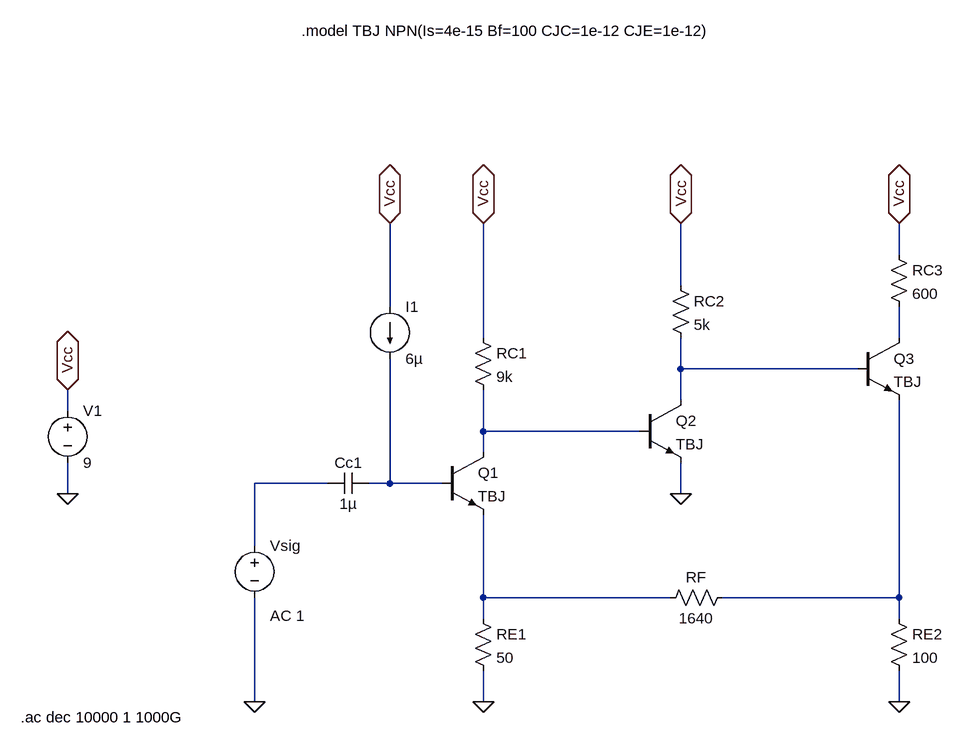
[diagram p0: schematic Realimentacao - Serie - Serie - TBJ - Emissor Comum.asc]
Realimentacao - Serie - Serie - TBJ - Emissor Comum.asc, the LTspice schematic file:
Version 4
SHEET 1 936 1096
WIRE 864 368 864 320
WIRE 528 416 528 320
WIRE 80 448 80 320
WIRE 224 496 224 320
WIRE 864 496 864 448
WIRE 528 544 528 496
WIRE 800 544 528 544
WIRE 528 592 528 544
WIRE -416 608 -416 576
WIRE 224 640 224 576
WIRE 464 640 224 640
WIRE 224 672 224 640
WIRE -16 720 -128 720
WIRE 80 720 80 528
WIRE 80 720 48 720
WIRE 160 720 80 720
WIRE -416 736 -416 688
WIRE 528 736 528 688
WIRE -128 816 -128 720
WIRE 224 896 224 768
WIRE 512 896 224 896
WIRE 864 896 864 592
WIRE 864 896 592 896
WIRE 224 928 224 896
WIRE 864 928 864 896
WIRE -128 1056 -128 896
WIRE 224 1056 224 1008
WIRE 864 1056 864 1008
FLAG 224 1056 0
FLAG 864 1056 0
FLAG 528 736 0
FLAG -416 736 0
FLAG -416 576 Vcc
IOPIN -416 576 BiDir
FLAG 224 320 Vcc
IOPIN 224 320 BiDir
FLAG 528 320 Vcc
IOPIN 528 320 BiDir
FLAG 864 320 Vcc
IOPIN 864 320 BiDir
FLAG -128 1056 0
FLAG 80 320 Vcc
IOPIN 80 320 BiDir
SYMBOL npn 160 672 R0
SYMATTR InstName Q1
SYMATTR Value TBJ
SYMBOL npn 464 592 R0
SYMATTR InstName Q2
SYMATTR Value TBJ
SYMBOL npn 800 496 R0
SYMATTR InstName Q3
SYMATTR Value TBJ
SYMBOL res 208 480 R0
SYMATTR InstName RC1
SYMATTR Value 9k
SYMBOL res 512 400 R0
SYMATTR InstName RC2
SYMATTR Value 5k
SYMBOL res 848 352 R0
SYMATTR InstName RC3
SYMATTR Value 600
SYMBOL res 208 912 R0
SYMATTR InstName RE1
SYMATTR Value 50
SYMBOL res 848 912 R0
SYMATTR InstName RE2
SYMATTR Value 100
SYMBOL res 496 912 R270
WINDOW 0 32 56 VTop 2
WINDOW 3 0 56 VBottom 2
SYMATTR InstName RF
SYMATTR Value 1640
SYMBOL voltage -416 592 R0
WINDOW 123 0 0 Left 0
WINDOW 39 0 0 Left 0
SYMATTR InstName V1
SYMATTR Value 9
SYMBOL cap -16 736 R270
WINDOW 0 32 32 VTop 2
WINDOW 3 0 32 VBottom 2
SYMATTR InstName Cc1
SYMATTR Value 1µ
SYMBOL voltage -128 800 R0
WINDOW 123 24 124 Left 2
WINDOW 39 0 0 Left 0
SYMATTR InstName Vsig
SYMATTR Value ""
SYMATTR Value2 AC 1
SYMBOL current 80 448 R0
WINDOW 123 0 0 Left 0
WINDOW 39 0 0 Left 0
SYMATTR InstName I1
SYMATTR Value 6µ
TEXT -56 24 Left 2 !.model TBJ NPN(Is=4e-15 Bf=100 CJC=1e-12 CJE=1e-12)
TEXT -488 1080 Left 2 !.ac dec 10000 1 1000G

The netlist it stands for:
* Realimentacao - Serie - Serie - TBJ - Emissor Comum.asc
Q1 N003 N005 N006 0 TBJ
Q2 N002 N003 0 0 TBJ
Q3 N001 N002 N007 0 TBJ
RC1 Vcc N003 9k
RC2 Vcc N002 5k
RC3 Vcc N001 600
RE1 N006 0 50
RE2 N007 0 100
RF N006 N007 1640
V1 Vcc 0 9
Cc1 N004 N005 1µ
Vsig N004 0 AC 1
I1 Vcc N005 6µ
.model NPN NPN
.model PNP PNP
.lib standard.bjt
.model TBJ NPN(Is=4e-15 Bf=100 CJC=1e-12 CJE=1e-12)
.ac dec 10000 1 1000G
.backanno
.end